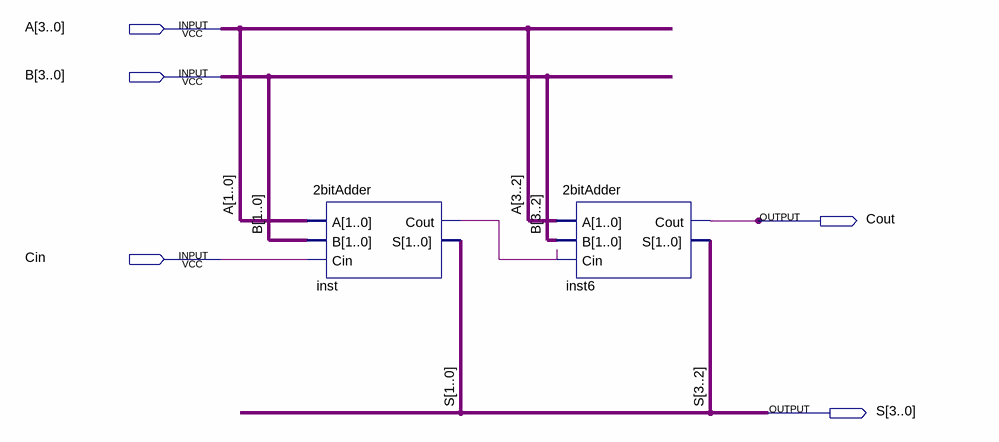
[diagram p0: schematic sheet]
// Quartus schematic 4bitadder.bdf as structural Verilog: 2 symbols, 5 pins
module \4bitadder  (
  input  [3:0] A,
  input  [3:0] B,
  input  Cin,
  output Cout,
  output [3:0] S
);

  wire inst_cout;

  \2bitAdder  inst (.A(A[1:0]), .B(B[1:0]), .Cin(Cin), .Cout(inst_cout), .S(S[1:0]));
  \2bitAdder  inst6 (.A(A[3:2]), .B(B[3:2]), .Cin(inst_cout), .Cout(Cout), .S(S[3:2]));
endmodule
